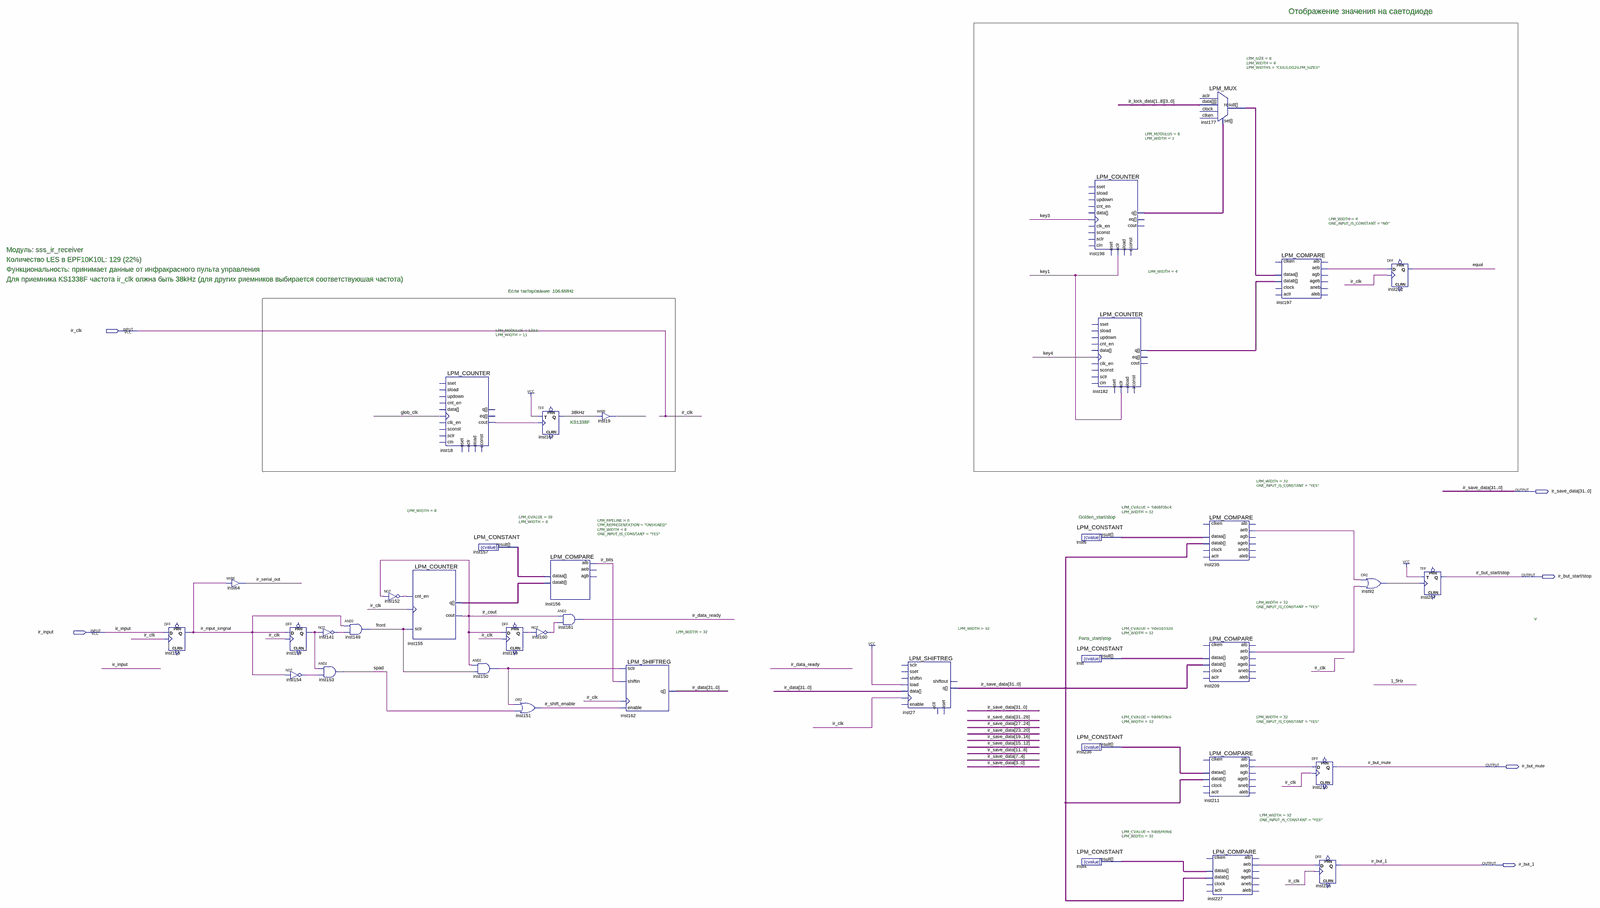
[diagram p0: schematic sheet, whole]
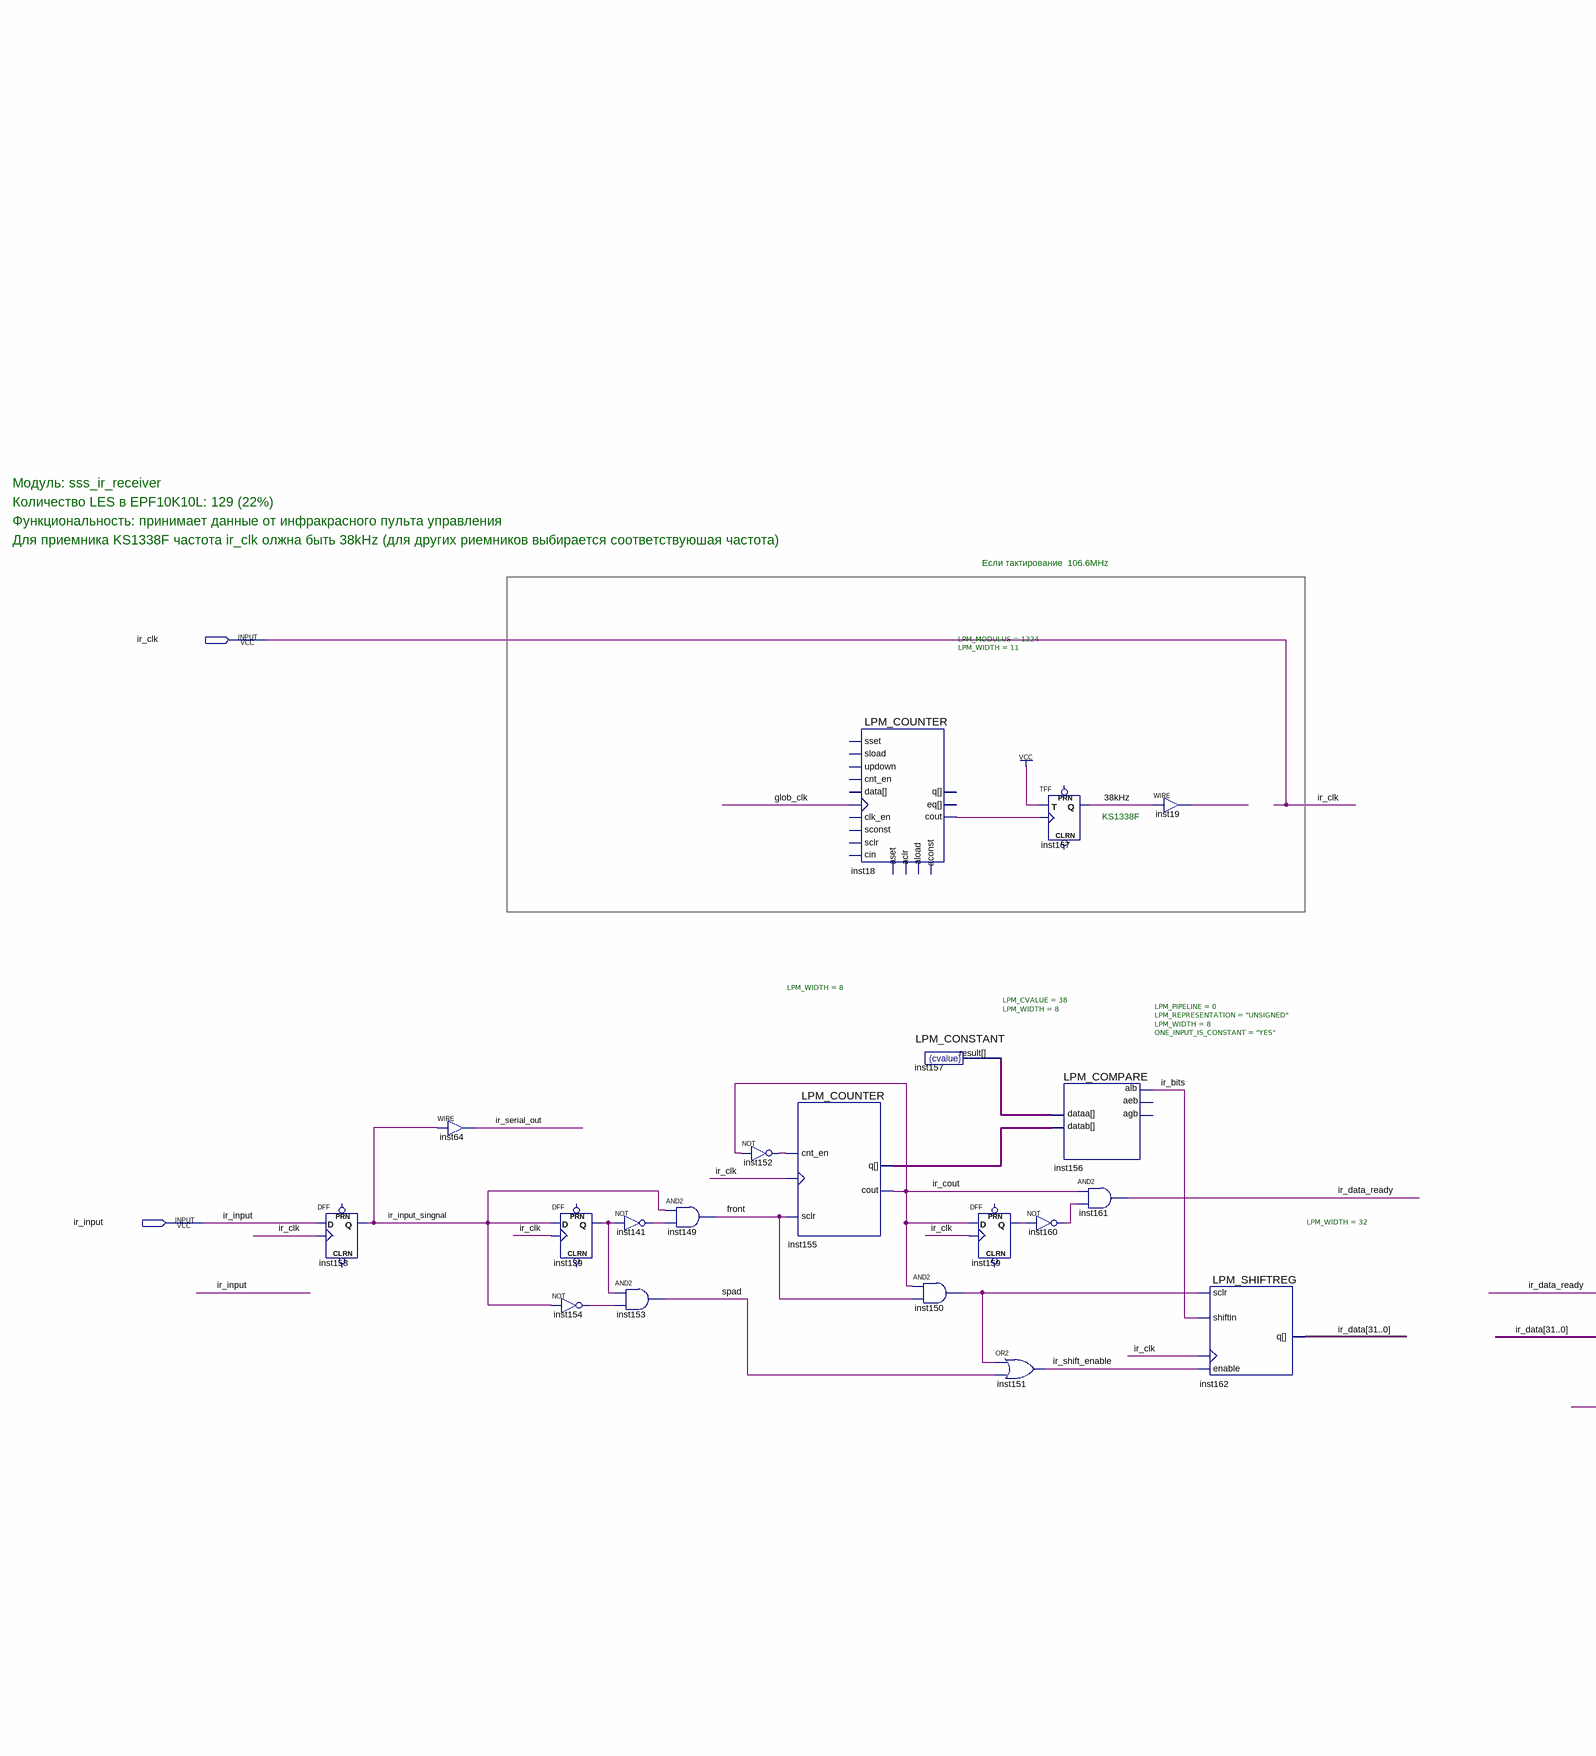
[diagram p1: schematic sheet, left part]
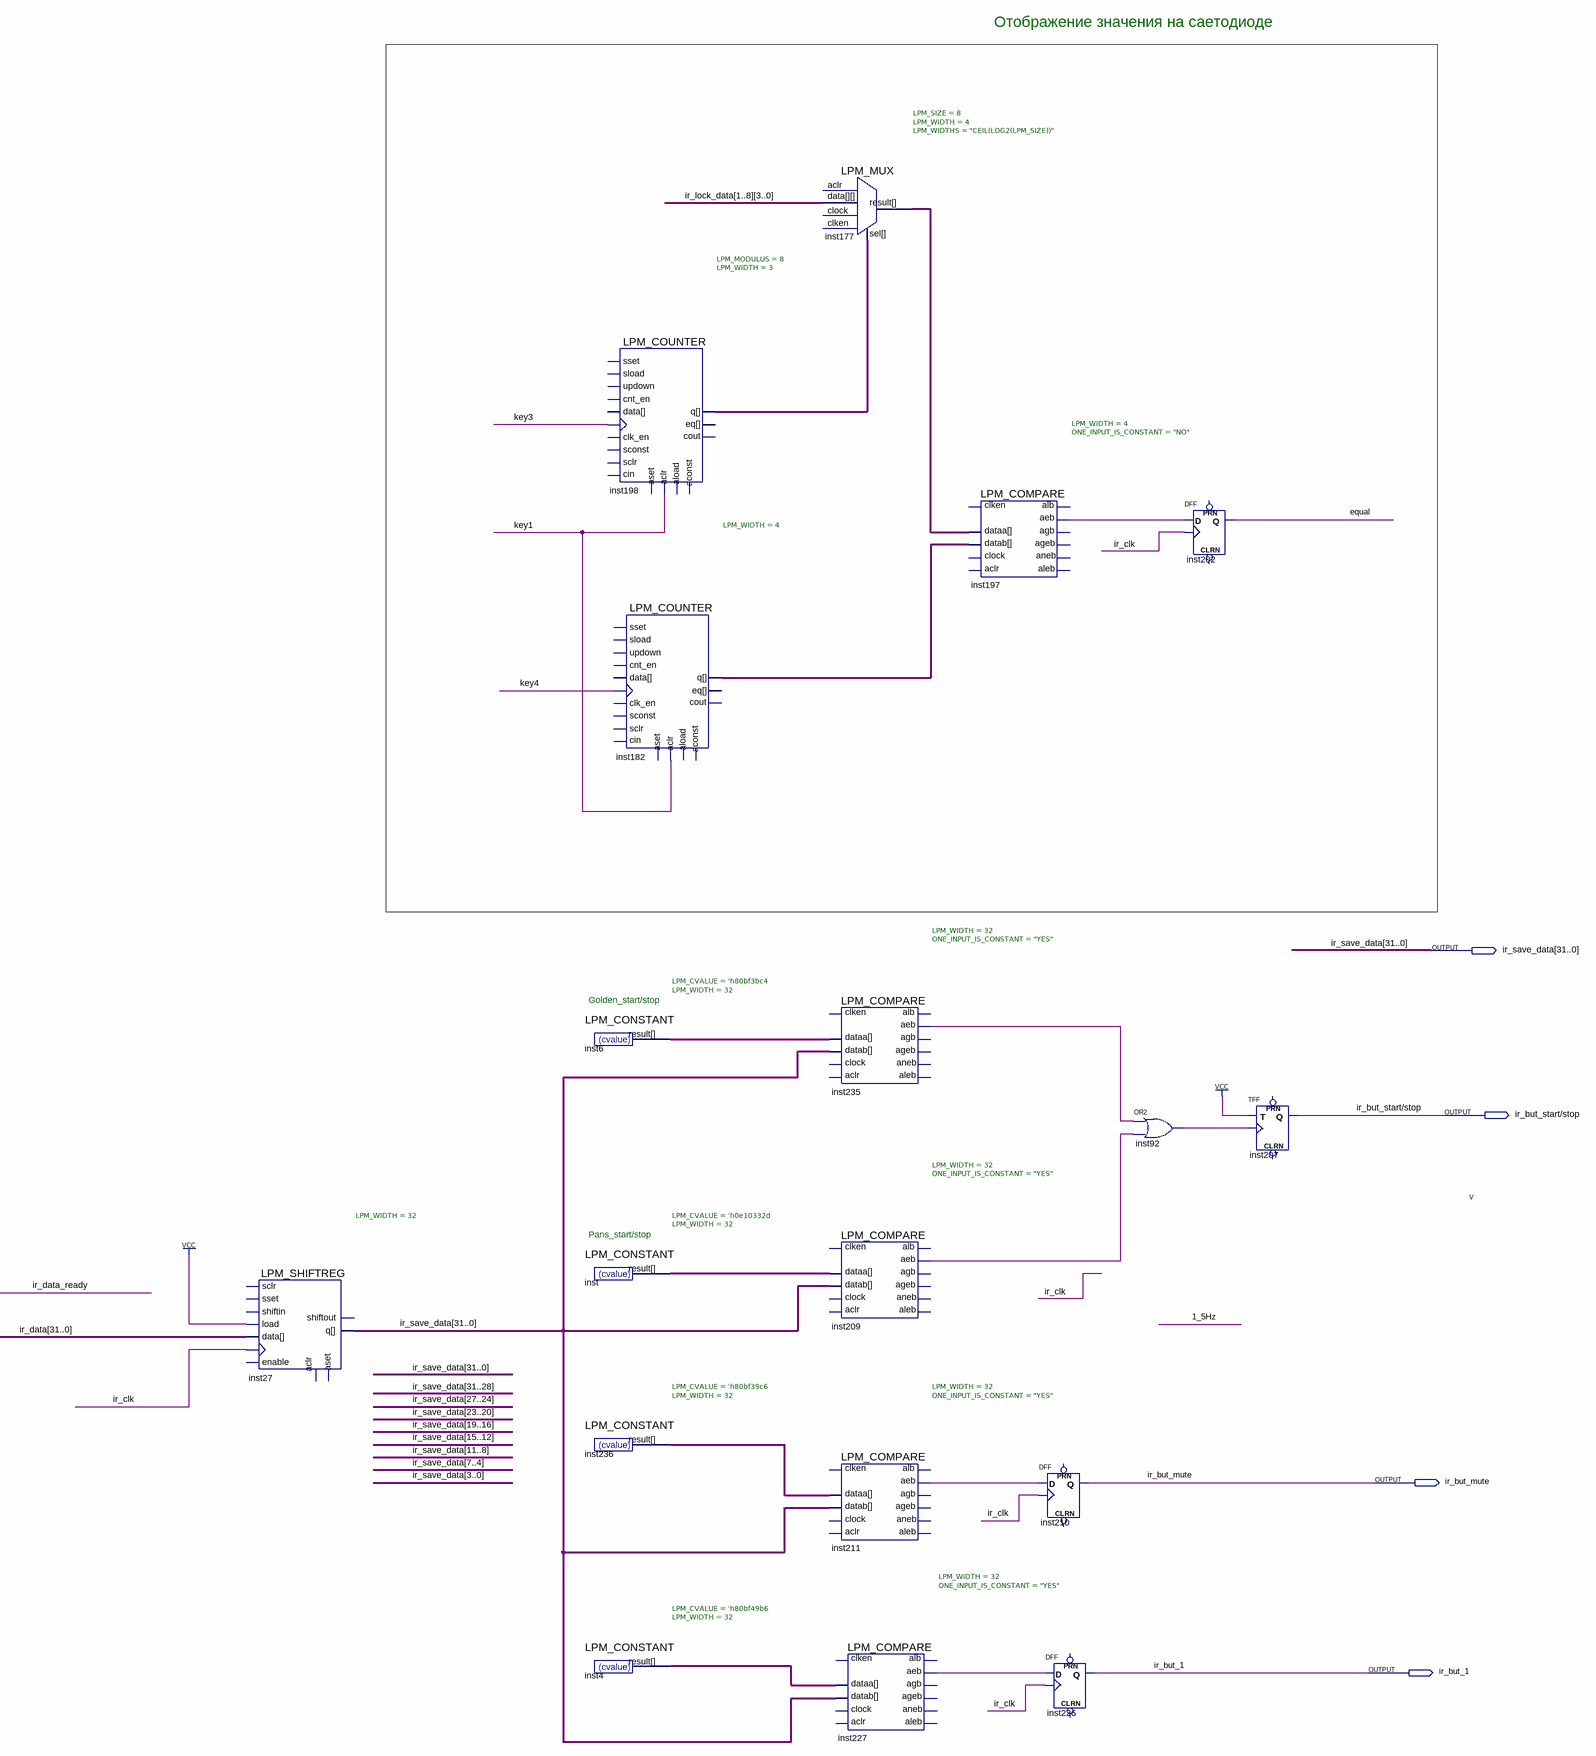
[diagram p2: schematic sheet, right part]
// Quartus schematic sss_ir_receiver.bdf as structural Verilog: 38 symbols, 6 pins
module sss_ir_receiver (
  input  ir_clk,
  input  ir_input,
  output [31:0] ir_save_data,
  output \ir_but_start/stop ,
  output ir_but_mute,
  output ir_but_1
);

  wire \38kHz , equal, front, glob_clk, inst18_cout, inst19_out, inst92_out, inst139_q, inst141_out,
       inst150_out, inst152_out, inst154_out, inst159_q, inst160_out, inst197_aeb, inst209_aeb, inst211_aeb,
       inst227_aeb, inst235_aeb, ir_bits, ir_cout, ir_data_ready, ir_input_singnal, ir_serial_out,
       ir_shift_enable, key1, key3, key4, spad;
  wire [2:0] inst198_q;
  wire [3:0] inst177_result, inst182_q, ir_lock_data_1, ir_lock_data_2, ir_lock_data_3, ir_lock_data_4,
       ir_lock_data_5, ir_lock_data_6, ir_lock_data_7, ir_lock_data_8;
  wire [7:0] inst155_q, inst157_result;
  wire [31:0] inst4_result, inst6_result, inst236_result, inst_result, ir_data;

  DFF inst158 (.CLK(ir_clk), .D(ir_input), .Q(ir_input_singnal));  // open: CLRN, PRN
  assign ir_serial_out = ir_input_singnal;  // WIRE inst64
  DFF inst139 (.CLK(ir_clk), .D(ir_input_singnal), .Q(inst139_q));  // open: CLRN, PRN
  not inst154 (inst154_out, ir_input_singnal);
  not inst141 (inst141_out, inst139_q);
  and inst153 (spad, inst139_q, inst154_out);
  and inst149 (front, ir_input_singnal, inst141_out);
  not inst152 (inst152_out, ir_cout);
  LPM_COUNTER #(.LPM_WIDTH(8)) inst155 (
    .cnt_en(inst152_out), .clock(ir_clk), .sclr(front), .q(inst155_q), .cout(ir_cout));
  LPM_COUNTER #(.LPM_MODULUS(1324), .LPM_WIDTH(11)) inst18 (
    .clock(glob_clk), .cout(inst18_cout));  // open: sset, sload, updown, cnt_en, data, clk_en, sconst, sclr, aload, aclr, aset, aconst, cin, q, eq
  LPM_CONSTANT #(.LPM_CVALUE(38), .LPM_WIDTH(8)) inst157 (.result(inst157_result));
  and inst150 (inst150_out, ir_cout, front);
  DFF inst159 (.CLK(ir_clk), .D(ir_cout), .Q(inst159_q));  // open: CLRN, PRN
  or inst151 (ir_shift_enable, inst150_out, spad);
  TFF inst167 (.T(1'b1), .CLK(inst18_cout), .Q(\38kHz ));  // open: PRN, CLRN
  LPM_COMPARE #(.LPM_PIPELINE(0), .LPM_REPRESENTATION("UNSIGNED"), .LPM_WIDTH(8), .ONE_INPUT_IS_CONSTANT("YES")) inst156 (
    .dataa(inst157_result), .datab(inst155_q), .alb(ir_bits));  // open: aeb, agb
  not inst160 (inst160_out, inst159_q);
  and inst161 (ir_data_ready, ir_cout, inst160_out);
  assign inst19_out = \38kHz ;  // WIRE inst19
  LPM_SHIFTREG #(.LPM_WIDTH(32)) inst162 (
    .shiftin(ir_bits), .enable(ir_shift_enable), .clock(ir_clk), .sclr(inst150_out), .q(ir_data));
  LPM_SHIFTREG #(.LPM_WIDTH(32)) inst27 (
    .clock(ir_clk), .data(ir_data), .load(1'b1), .q(ir_save_data));  // open: shiftin, sset, enable, sclr, aset, aclr, shiftout
  LPM_COUNTER #(.LPM_MODULUS(8), .LPM_WIDTH(3)) inst198 (
    .clock(key3), .aclr(key1), .q(inst198_q));  // open: sset, sload, updown, cnt_en, data, clk_en, sconst, sclr, aload, aset, aconst, cin, eq, cout
  LPM_COUNTER #(.LPM_WIDTH(4)) inst182 (
    .clock(key4), .aclr(key1), .q(inst182_q));  // open: sset, sload, updown, cnt_en, data, clk_en, sconst, sclr, aload, aset, aconst, cin, eq, cout
  LPM_CONSTANT #(.LPM_CVALUE('h80bf3bc4), .LPM_WIDTH(32)) inst6 (.result(inst6_result));
  LPM_CONSTANT #(.LPM_CVALUE('h0e10332d), .LPM_WIDTH(32)) inst (.result(inst_result));
  LPM_CONSTANT #(.LPM_CVALUE('h80bf39c6), .LPM_WIDTH(32)) inst236 (.result(inst236_result));
  LPM_CONSTANT #(.LPM_CVALUE('h80bf49b6), .LPM_WIDTH(32)) inst4 (.result(inst4_result));
  LPM_MUX #(.LPM_SIZE(8), .LPM_WIDTH(4), .LPM_WIDTHS("CEIL(LOG2(LPM_SIZE))")) inst177 (
    .data({ir_lock_data_1, ir_lock_data_2, ir_lock_data_3, ir_lock_data_4, ir_lock_data_5, ir_lock_data_6, ir_lock_data_7, ir_lock_data_8}),
    .sel(inst198_q), .result(inst177_result));  // open: clock, aclr, clken
  LPM_COMPARE #(.LPM_WIDTH(32), .ONE_INPUT_IS_CONSTANT("YES")) inst235 (
    .dataa(inst6_result), .datab(ir_save_data), .aeb(inst235_aeb));  // open: clock, aclr, clken, aleb, agb, aneb, ageb, alb
  LPM_COMPARE #(.LPM_WIDTH(32), .ONE_INPUT_IS_CONSTANT("YES")) inst209 (
    .dataa(inst_result), .datab(ir_save_data), .aeb(inst209_aeb));  // open: clock, aclr, clken, aleb, agb, aneb, ageb, alb
  LPM_COMPARE #(.LPM_WIDTH(32), .ONE_INPUT_IS_CONSTANT("YES")) inst211 (
    .dataa(inst236_result), .datab(ir_save_data), .aeb(inst211_aeb));  // open: clock, aclr, clken, aleb, agb, aneb, ageb, alb
  LPM_COMPARE #(.LPM_WIDTH(32), .ONE_INPUT_IS_CONSTANT("YES")) inst227 (
    .dataa(inst4_result), .datab(ir_save_data), .aeb(inst227_aeb));  // open: clock, aclr, clken, aleb, agb, aneb, ageb, alb
  LPM_COMPARE #(.LPM_WIDTH(4), .ONE_INPUT_IS_CONSTANT("NO")) inst197 (
    .dataa(inst177_result), .datab(inst182_q), .aeb(inst197_aeb));  // open: clock, aclr, clken, aleb, agb, aneb, ageb, alb
  DFF inst210 (.CLK(ir_clk), .D(inst211_aeb), .Q(ir_but_mute));  // open: CLRN, PRN
  DFF inst226 (.CLK(ir_clk), .D(inst227_aeb), .Q(ir_but_1));  // open: CLRN, PRN
  or inst92 (inst92_out, inst235_aeb, inst209_aeb);
  DFF inst202 (.CLK(ir_clk), .D(inst197_aeb), .Q(equal));  // open: CLRN, PRN
  TFF inst207 (.T(1'b1), .CLK(inst92_out), .Q(\ir_but_start/stop ));  // open: PRN, CLRN

  // Notes on the sheet:
  //   Отображение значения на саетодиоде
  //   Модуль: sss_ir_receiver
  //   Количество LES в EPF10K10L: 129 (22%)
  //   Функциональность: принимает данные от инфракрасного пульта управления
  //   Для приемника KS1338F частота ir_clk олжна быть 38kHz (для других риемников выбирается соответствуюшая частота)
  //   Если тактирование  106.6MHz
  //   KS1338F
  //   Golden_start/stop
  //   v
  //   Pans_start/stop
endmodule
